# Altium schematic sheet LEDBAKL_TPS61042.SchDoc
size A3
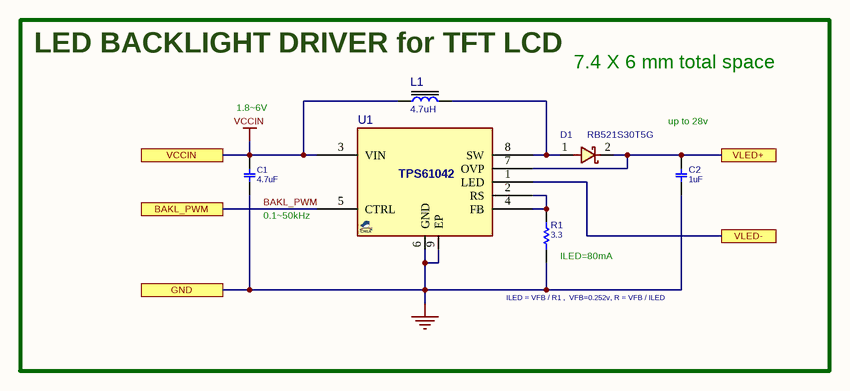
[diagram p0: LEDBAKL_TPS61042.SchDoc]

## Parts
C1  4.7uF  [C0402]
C2  1uF  [C0603]
D1  RB521S30T5G  [D_SOD523]
L1  4.7uH  [L0603]
R1  3.3  [R0402]
U1  TPS61042  [SON65_8T_3030]  (value not drawn)

## Ports
BAKL_PWM, GND, VCCIN, VLED+, VLED-

## Nets
GND: C1.1 C2.1 R1.2 U1.6(GND) U1.9(EP) ; port GND
VCCIN: C1.2 L1.1 U1.3(VIN) ; port VCCIN
BAKL_PWM: U1.5(CTRL) ; port BAKL_PWM
VLED+: C2.2 D1.2 U1.7(OVP) ; port VLED+
VLED-: U1.1(LED) ; port VLED-
NetD1_1: D1.1 L1.2 U1.8(SW)
NetR1_1: R1.1 U1.2(RS) U1.4(FB)

## Notes on the sheet
- (near L1) LED BACKLIGHT DRIVER for TFT LCD
- 1.8~6V
- 7.4 X 6 mm total space
- (near C2) up to 28v
- 0.1~50kHz
- ILED = VFB / R1 ,  VFB=0.252v, R = VFB / ILED
- (near R1) ILED=80mA

## Library data of the parts
C1 = CAP_SMD_MLCC: CAP, MLCC; PARAM: X5R, 10%; MANF_P#: CL05A475MP5NRNC; MANF: Samsung; PARAM2: 10v; PRICE: 10,000:	$0.013; ASSEMBLY: ASSEMBLY; VALUE: 4.7uF
C2 = CAP_SMD_MLCC: CAP, MLCC; PARAM: X5R, 10%; MANF_P#: CL10A105KB8NNNC; MANF: Samsung; PARAM2: 50v; PRICE: 50,000:	$0.006; ASSEMBLY: ASSEMBLY; VALUE: 1uF
D1 = DIODE_SMD_SCHOTTKY_1N5819: DIODE, SCHOTTKY; MANF: DIODES; DESC: DESCRIPTION; PARAM2: 0.2A; PARAM: 30V; MANF_P#: RB521S30T5G; ASSEMBLY: ASSEMBLY; PRICE: PRICE; VALUE: RB521S30T5G
L1 = INDPWR_SMD: INDUCTOR, POWER, SMD; MANF_P#: MLZ1608E4R7MT; PARAM: 0.35A, 0.5Ohm; VALUE: 4.7uH
R1 = RES_SMD: RESISTOR, SMD, 20K, 0402; MANF: Yageo; PARAM: 0.063W; DIST#: MOUSER; PARAM2: 1%; MANF_P#: RK73H1ETTP2002F; ASSEMBLY: ASSEMBLY; PRICE: 100= 0.5$; DESC: RESISTOR, SMD, 20K, 0402; VALUE: 3.3
U1 = VREG_TPS61042_SON8: REG, Switching, Boost, 0.5A, ADJ, 1MHz; PARAM: 0.5A, ADJ 30v; PARAM2: 1MHz, 1.8~6VIN; MANF_P#: TPS61042DRB; MANF: TI; VALUE: TPS61042; PACKAGE: SON-8